# Altium schematic sheet WS2812B.SchDoc
size A
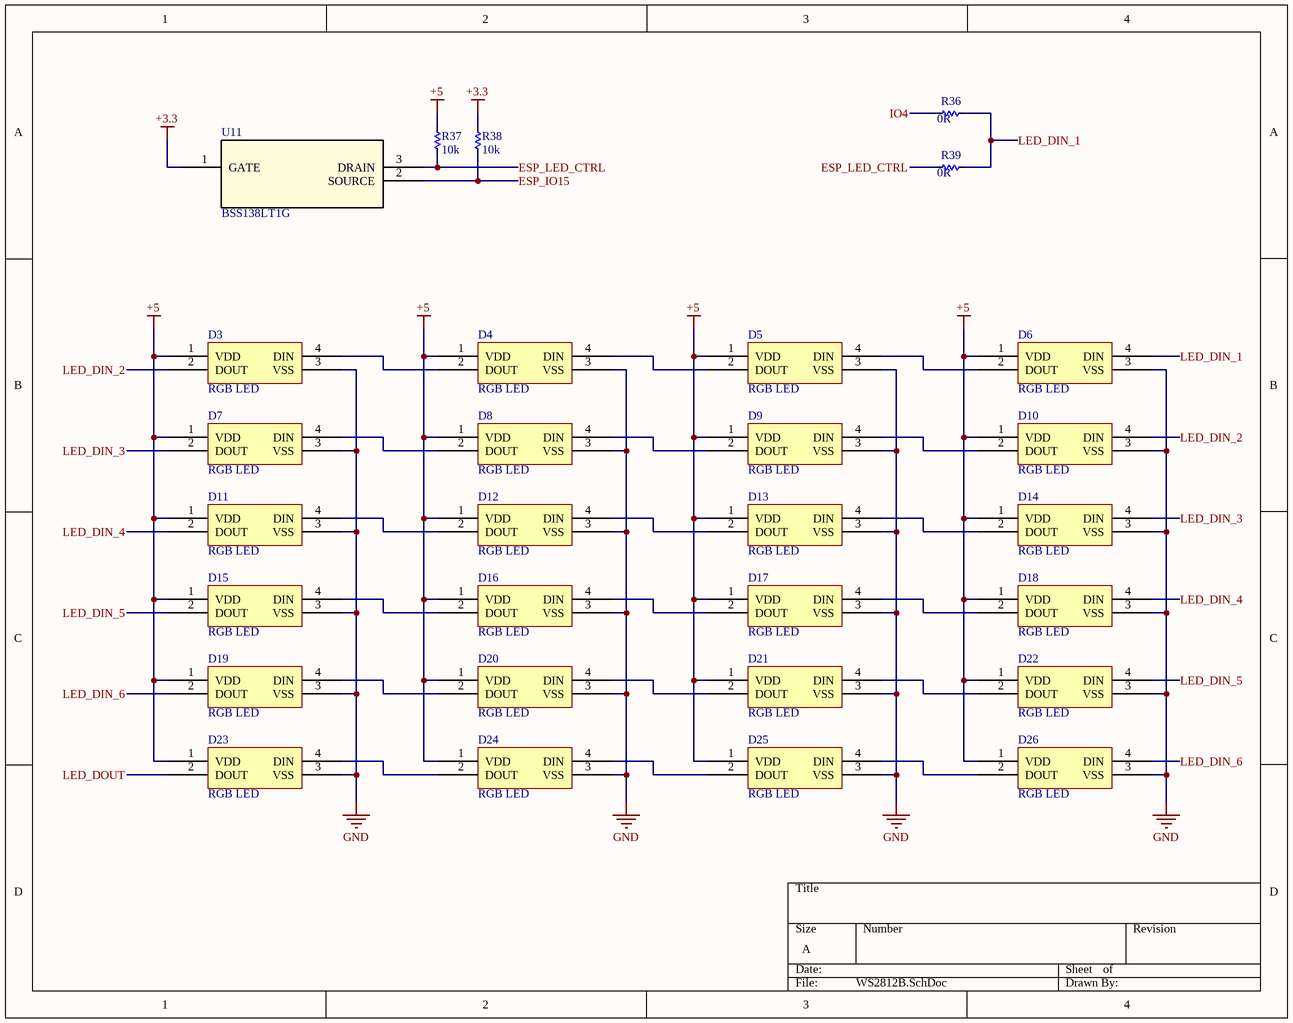
[diagram p0: WS2812B.SchDoc]

## Parts
D3  RGB LED  [WS2812B]
D4  RGB LED  [WS2812B]
D5  RGB LED  [WS2812B]
D6  RGB LED  [WS2812B]
D7  RGB LED  [WS2812B]
D8  RGB LED  [WS2812B]
D9  RGB LED  [WS2812B]
D10  RGB LED  [WS2812B]
D11  RGB LED  [WS2812B]
D12  RGB LED  [WS2812B]
D13  RGB LED  [WS2812B]
D14  RGB LED  [WS2812B]
D15  RGB LED  [WS2812B]
D16  RGB LED  [WS2812B]
D17  RGB LED  [WS2812B]
D18  RGB LED  [WS2812B]
D19  RGB LED  [WS2812B]
D20  RGB LED  [WS2812B]
D21  RGB LED  [WS2812B]
D22  RGB LED  [WS2812B]
D23  RGB LED  [WS2812B]
D24  RGB LED  [WS2812B]
D25  RGB LED  [WS2812B]
D26  RGB LED  [WS2812B]
R36  value 0R  [RES-SMD-0603]  (hidden comment: Res)
R37  value 10k  [RES-SMD-0603]  (hidden comment: Res)
R38  value 10k  [RES-SMD-0603]  (hidden comment: Res)
R39  value 0R  [RES-SMD-0603]  (hidden comment: Res)
U11  BSS138LT1G  [SOT23-3_ONS]

## Nets
+3.3: R38.1 U11.1(GATE)
+5: D3.1(VDD) D4.1(VDD) D5.1(VDD) D6.1(VDD) D7.1(VDD) D8.1(VDD) D9.1(VDD) D10.1(VDD) D11.1(VDD) D12.1(VDD) D13.1(VDD) D14.1(VDD) D15.1(VDD) D16.1(VDD) D17.1(VDD) D18.1(VDD) D19.1(VDD) D20.1(VDD) D21.1(VDD) D22.1(VDD) D23.1(VDD) D24.1(VDD) D25.1(VDD) D26.1(VDD) R37.1
GND: D3.3(VSS) D4.3(VSS) D5.3(VSS) D6.3(VSS) D7.3(VSS) D8.3(VSS) D9.3(VSS) D10.3(VSS) D11.3(VSS) D12.3(VSS) D13.3(VSS) D14.3(VSS) D15.3(VSS) D16.3(VSS) D17.3(VSS) D18.3(VSS) D19.3(VSS) D20.3(VSS) D21.3(VSS) D22.3(VSS) D23.3(VSS) D24.3(VSS) D25.3(VSS) D26.3(VSS)
ESP_IO15: R38.2 U11.2(SOURCE)
ESP_LED_CTRL: R37.2 R39.2 U11.3(DRAIN)
IO4: R36.2
LED_DIN_1: D6.4(DIN) R36.1 R39.1
LED_DIN_2: D3.2(DOUT) D10.4(DIN)
LED_DIN_3: D7.2(DOUT) D14.4(DIN)
LED_DIN_4: D11.2(DOUT) D18.4(DIN)
LED_DIN_5: D15.2(DOUT) D22.4(DIN)
LED_DIN_6: D19.2(DOUT) D26.4(DIN)
LED_DOUT: D23.2(DOUT)
NetD3_4: D3.4(DIN) D4.2(DOUT)
NetD4_4: D4.4(DIN) D5.2(DOUT)
NetD5_4: D5.4(DIN) D6.2(DOUT)
NetD7_4: D7.4(DIN) D8.2(DOUT)
NetD8_4: D8.4(DIN) D9.2(DOUT)
NetD9_4: D9.4(DIN) D10.2(DOUT)
NetD11_4: D11.4(DIN) D12.2(DOUT)
NetD12_4: D12.4(DIN) D13.2(DOUT)
NetD13_4: D13.4(DIN) D14.2(DOUT)
NetD15_4: D15.4(DIN) D16.2(DOUT)
NetD16_4: D16.4(DIN) D17.2(DOUT)
NetD17_4: D17.4(DIN) D18.2(DOUT)
NetD19_4: D19.4(DIN) D20.2(DOUT)
NetD20_4: D20.4(DIN) D21.2(DOUT)
NetD21_4: D21.4(DIN) D22.2(DOUT)
NetD23_4: D23.4(DIN) D24.2(DOUT)
NetD24_4: D24.4(DIN) D25.2(DOUT)
NetD25_4: D25.4(DIN) D26.2(DOUT)

## Library data of the parts
D3-D26 = WS2812B: RGB 620~630nm Red, 515~530nm Green, 465~475nm Blue SMD,5x5mm Light Emitting Diodes (LED) ROHS; Manufacturer: Worldsemi; Value: WS2812B
R36-R39 = Res-SMD: Resistor; Manufacturer: Generic Components; Class: Passive; Published: 08/06/2000; Publisher: Altium Hobart Technology Centre
U11 = BSS138LT1G: No Description Available; Vendor: ON Semiconductor; Built_By: EMA_Jessica; SourceLibrary: ON_Semiconductor_2019-12-30; Manufacturer_Part_Number: BSS138LT1G; Copyright: Copyright (C) 2018 Accelerated Designs. All rights reserved; RefDes: RefDes; Type: DEV